# EAGLE schematic switches_schema (EAGLE 9.2.2)
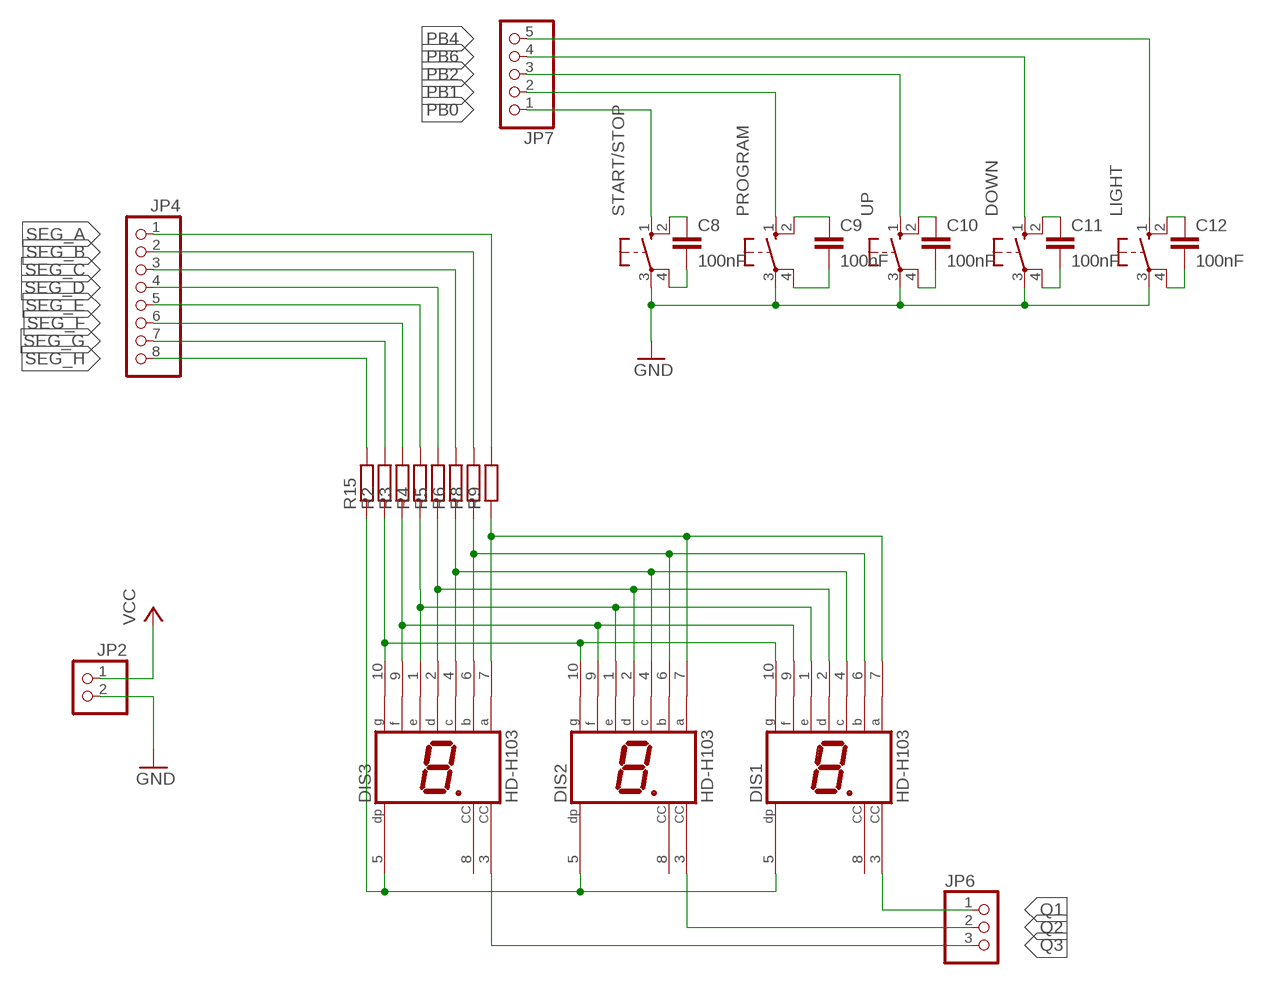
[diagram p0: schematic, sheet 1]

## Parts
C8  100nF  C-EU025-024X044  [C025-024X044]
C9  100nF  C-EU025-024X044  [C025-024X044]
C10  100nF  C-EU025-024X044  [C025-024X044]
C11  100nF  C-EU025-024X044  [C025-024X044]
C12  100nF  C-EU025-024X044  [C025-024X044]
DIS1  HD-H103  [HDSP-M]
DIS2  HD-H103  [HDSP-M]
DIS3  HD-H103  [HDSP-M]
DOWN  10-XX  [B3F-10XX]
JP2  PINHD-1X2  [1X02]
JP4  PINHD-1X8  [1X08]
JP6  PINHD-1X3  [1X03]
JP7  PINHD-1X5  [1X05]
LIGHT  10-XX  [B3F-10XX]
PROGRAM  10-XX  [B3F-10XX]
R2  R-EU_0204/7  [0204/7]
R3  R-EU_0204/7  [0204/7]
R4  R-EU_0204/7  [0204/7]
R5  R-EU_0204/7  [0204/7]
R6  R-EU_0204/7  [0204/7]
R8  R-EU_0204/7  [0204/7]
R9  R-EU_0204/7  [0204/7]
R15  R-EU_0204/7  [0204/7]
START/STOP  10-XX  [B3F-10XX]
UP  10-XX  [B3F-10XX]

## Nets
5V: JP2.1 ; supply symbol labelled VCC
GND: DOWN.3(P) JP2.2 LIGHT.3(P) PROGRAM.3(P) START/STOP.3(P) UP.3(P)
N$4: DIS1.4(C) DIS2.4(C) DIS3.4(C) R6.1
N$5: DIS1.5(DP) DIS2.5(DP) DIS3.5(DP) R15.1
N$7: DIS1.7(A) DIS2.7(A) DIS3.7(A) R9.1
N$23: C8.1 START/STOP.2(S1)
N$24: C8.2 START/STOP.4(P1)
N$26: C9.2 PROGRAM.4(P1)
N$27: DIS1.10(G) DIS2.10(G) DIS3.10(G) R2.1
N$30: DIS1.1(E) DIS2.1(E) DIS3.1(E) R4.1
N$32: C10.2 UP.4(P1)
N$33: DIS1.9(F) DIS2.9(F) DIS3.9(F) R3.1
N$34: C11.2 DOWN.4(P1)
N$39: C10.1 UP.2(S1)
N$40: C11.1 DOWN.2(S1)
N$42: DIS1.6(B) DIS2.6(B) DIS3.6(B) R8.1
N$45: C9.1 PROGRAM.2(S1)
N$48: C12.1 LIGHT.2(S1)
N$59: C12.2 LIGHT.4(P1)
N$60: DIS1.2(D) DIS2.2(D) DIS3.2(D) R5.1
PB0: JP7.1 START/STOP.1(S)
PB1: JP7.2 PROGRAM.1(S)
PB2: JP7.3 UP.1(S)
PB4: JP7.5 LIGHT.1(S)
PB6: DOWN.1(S) JP7.4
Q1: DIS1.3(CC) JP6.1
Q2: DIS2.3(CC) JP6.2
Q3: DIS3.3(CC) JP6.3
SEG_A: JP4.1 R9.2
SEG_B: JP4.2 R8.2
SEG_C: JP4.3 R6.2
SEG_D: JP4.4 R5.2
SEG_E: JP4.5 R4.2
SEG_F: JP4.6 R3.2
SEG_G: JP4.7 R2.2
SEG_H: JP4.8 R15.2
Unconnected: DIS1.8(CC) DIS2.8(CC) DIS3.8(CC)

## Library data of the parts
C8-C12 = rcl:C-EU: CAPACITOR, European symbol
DIS1-DIS3 = display-hp:HD-H103: LED DISPLAY 1-character 7 segment, decimal point right; OC_FARNELL: unknown; OC_NEWARK: unknown
DOWN LIGHT PROGRAM START/STOP UP = switch-omron:10-XX: OMRON SWITCH; MPN: B3F-1000; OC_FARNELL: 176432; OC_NEWARK: 36M3542
JP2 = pinhead:PINHD-1X2: PIN HEADER
JP4 = pinhead:PINHD-1X8: PIN HEADER
JP6 = pinhead:PINHD-1X3: PIN HEADER
JP7 = pinhead:PINHD-1X5: PIN HEADER
R2-R6 R8 R9 R15 = rcl:R-EU_: RESISTOR, European symbol